# Altium schematic sheet Sensors.SchDoc
size A; SheetNumber: 6; SheetTotal: 7
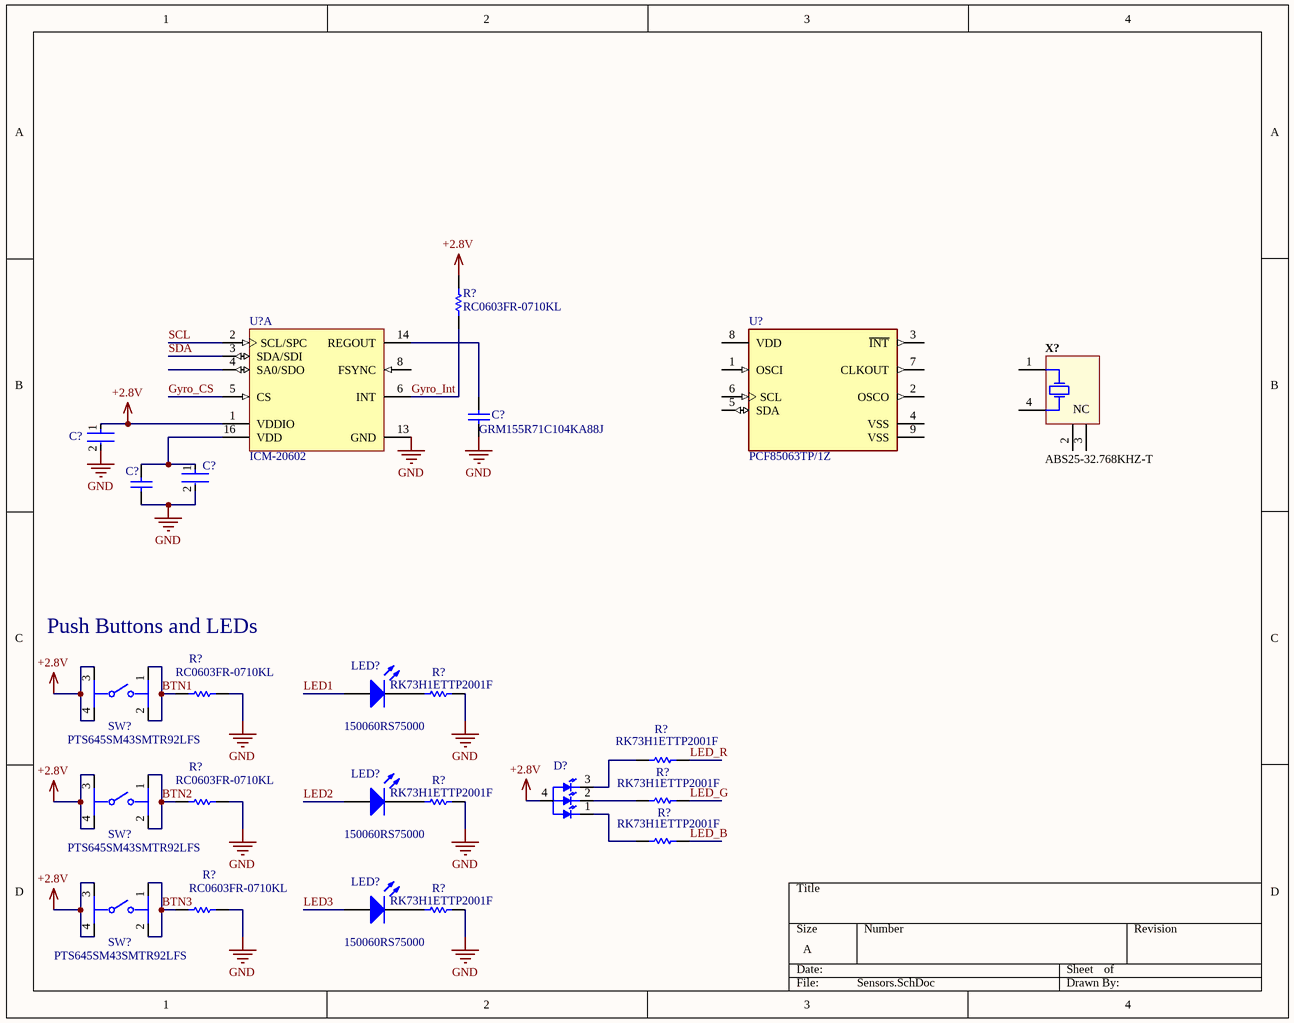
[diagram p0: Sensors.SchDoc]

## Parts
(Parts that share a designator on the sheet are numbered #1, #2 ... from top to bottom, then left to right.)
C?#1  CL10A225KO8NNNC  [FP-CL10-IPC_A]  (value not drawn)
C?#2  GRM155R71C104KA88J  [CAPC1005X55X25LL05T10]
C?#3  CL10A225KO8NNNC  [FP-CL10-IPC_A]  (value not drawn)
C?#4  GRM155R71C104KA88J  [CAPC1005X55X25LL05T10]  (value not drawn)
D?  UHD1110-FKA-CL1A13R3Q1BBQFMF3  [LED_UHD1110-FKA-CL1A13R3Q1BBQFMF3]  (value not drawn)
LED?#1  150060RS75000  [0603_A]
LED?#2  150060RS75000  [0603_A]
LED?#3  150060RS75000  [0603_A]
R?#1  RC0603FR-0710KL  [RESC1608X55X25ML10T15]
R?#2  RK73H1ETTP2001F  [RESC1005X40X25LL10T10]
R?#3  RC0603FR-0710KL  [RESC1608X55X25ML10T15]
R?#4  RK73H1ETTP2001F  [RESC1005X40X25LL10T10]
R?#5  RK73H1ETTP2001F  [RESC1005X40X25LL10T10]
R?#6  RK73H1ETTP2001F  [RESC1005X40X25LL10T10]
R?#7  RC0603FR-0710KL  [RESC1608X55X25ML10T15]
R?#8  RK73H1ETTP2001F  [RESC1005X40X25LL10T10]
R?#9  RK73H1ETTP2001F  [RESC1005X40X25LL10T10]
R?#10  RC0603FR-0710KL  [RESC1608X55X25ML10T15]
SW?#1  PTS645SM43SMTR92LFS  [FP-PTS645SM43SMTR92LFS-MFG]
SW?#2  PTS645SM43SMTR92LFS  [FP-PTS645SM43SMTR92LFS-MFG]
SW?#3  PTS645SM43SMTR92LFS  [FP-PTS645SM43SMTR92LFS-MFG]
U?#1  ICM-20602  [INSE-I62-16]  (part A of 2)
U?#2  PCF85063TP/1Z  [FP-SOT1069-2-MFG]
X?  ABS25-32.768KHZ-T  [ABRA-ABS25-4_V]

## Nets
+2.8V: C?#1.1 D?.4(ANODE) R?#1.2 SW?#1.3 SW?#1.4 SW?#2.3 SW?#2.4 SW?#3.3 SW?#3.4 U?#1.1(VDDIO)
GND: C?#1.2 C?#2.1 C?#3.2 C?#4.1 R?#2.2 R?#3.2 R?#5.2 R?#7.2 R?#9.2 R?#10.2 U?#1.13(GND)
BTN1: R?#3.1 SW?#1.1 SW?#1.2
BTN2: R?#7.1 SW?#2.1 SW?#2.2
BTN3: R?#10.1 SW?#3.1 SW?#3.2
Gyro_CS: U?#1.5(CS)
Gyro_Int: R?#1.1 U?#1.6(INT)
LED1: LED?#1.2(A)
LED2: LED?#2.2(A)
LED3: LED?#3.2(A)
LED_B: R?#8.2
LED_G: R?#6.2
LED_R: R?#4.2
SCL: U?#1.2(SCL/SPC)
SDA: U?#1.3(SDA/SDI)
NetC?#2_2: C?#2.2 U?#1.14(REGOUT)
NetC?#3_1: C?#3.1 C?#4.2 U?#1.16(VDD)
NetD?_1: D?.1(BLUE) R?#8.1
NetD?_2: D?.2(GREEN) R?#6.1
NetD?_3: D?.3(RED) R?#4.1
NetLED?#1_1: LED?#1.1(K) R?#2.1
NetLED?#2_1: LED?#2.1(K) R?#5.1
NetLED?#3_1: LED?#3.1(K) R?#9.1

Not connected (* = marked no-connect by the designer): U?#1 4(SA0/SDO) 8(FSYNC); U?#2 1(OSCI) 2(OSCO) 3(~{INT}) 4(VSS) 5(SDA) 6(SCL) 7(CLKOUT) 8(VDD) 9(VSS); X? 1(X1) 2(NC) 3(NC) 4(X2)

## Notes on the sheet
- Push Buttons and LEDs

## Library data of the parts
C?#1 C?#3 = CMP-13271-000835-1: Cap Ceramic 2.2uF 16V X5R ±10% Pad SMD 0603 +85°C T/R; Case Code (Metric): 1608; Height: 0.8mm; Case/Package: 0603; Depth: 0.8mm; Capacitance: 2.2uF; Voltage Rating: 16V; Case Code (Imperial): 0603; Length: 1.6mm; Packaging: Tape and Reel; Material: Ceramic; Lead Free: Lead Free; Max Operating Temperature: 85°C; Contact Plating: Tin; Thickness: 0.035inch; Radiation Hardening: No; Tolerance: 10%; Min Operating Temperature: -55°C; Voltage: 16V; Dielectric: X5R; Mount: Surface Mount; Package Quantity: 4000; Width: 0.031inch; Voltage Rating (DC): 16V
C?#2 C?#4 = CMP-2008-03928-1: Manufacturer: Murata; Part Number: GRM155R71C104KA88J
D? = UHD1110-FKA-CL1A13R3Q1BBQFMF3: Red, Green, Blue _RGB_ LED Indication - Discrete 1.9V Red, 2.9V Green, 2.9V Blue 0404 _1010 Metric_; MF: Cree Inc.; Price: None; Package: 0404 Cree Inc.; SnapEDA_Link: https://www.snapeda.com/parts/UHD1110-FKA-CL1A13R3Q1BBQFMF3/Cree%20Inc./view-part/2684282/?ref=snap; Value: *; MP: UHD1110-FKA-CL1A13R3Q1BBQFMF3; Availability: Unavailable
LED?#1-LED?#3 = CMP-1426-00001-1: SMD mono-color Chip LED, WL-SMCW, Red; Manufacturer: Wuerth Elektronik; Color: Red; PackageReference: 0603_A; ComponentLink2URL: http://katalog.we-online.com/led/datasheet/150060RS75000.pdf; ComponentLink1URL: http://www.we-online.com; ComponentLink1Description: Manufacturer URL; ComponentLink2Description: Datasheet; PartNumber: 150060RS75000
R?#1 R?#3 R?#7 R?#10 = CMP-2100-03664-1: Chip Resistor, 10 KOhm, +/- 1%, 01 W, -55 to 155 degC, 0603 (1608 Metric), RoHS, Tape and Reel; Manufacturer: Yageo; Temperature Coefficient: 100ppm/degreesC; Resistance: 10KOhm; Voltage Rating: 75V; Power Rating: 100mW; Voltage Rating (DC): 50V; Composition: ThickFilm; RoHSCompliant: true; Height: 0.45mm; Lead Free: LeadFree; Case Code (Metric): 1608; Case/Package: 0603; Datasheet Version: Rev. 5, 10/2016; Package Reference: 0603; Depth: 0.8mm; Package Description: 2-Pin Surface Mount Device, Body 1.6 x 0.8 mm; Case Code (Imperial): 0603; Packaging: TapeandReel; Termination: SMD/SMT; Lead Pitch: 0.3mm; Width: 0.8mm; Number of Pins: 2; Length: 1.6mm; REACH SVHC: NoSVHC; Military Standard: Not; Max Operating Temperature: 155degC; Min Operating Temperature: -55degC; Manufacturer URL: http://www.yageo.com/; Datasheet URL: http://www.yageo.com/NewPortal/yageodocoutput?fileName=/pdf/R-Chip/PYu-RC_Group_51_RoHS_L_5.pdf; Weight: 7.1E-05oz; Tolerance: 1%
R?#2 R?#4-R?#6 R?#8 R?#9 = CMP-2002-04283-1: Manufacturer: KOA Speer; Part Number: RK73H1ETTP2001F
SW?#1-SW?#3 = CMP-2000-05160-2: SWITCH TACTILE SPST-NO 0.05A 12V; Contact Resistance: 100mR; Throw Configuration: SPST; Illumination Type: Non-Illuminated; Mechanical Life: 100000Cycles; Current Rating: 50mA; Switch Function: Off-Mom; Actuator Length: 0.85mm; Actuator Material: Nylon; Actuator Type: Standard; Operating Force: 160gf; Min Operating Temperature: -20°C; REACH SVHC: No SVHC; Termination: Gull Wing; Case/Package: SMD/SMT; Packaging: Tape and Reel; Mount: Surface Mount; Voltage Rating (DC): 12V; Orientation: Straight; Lead Free: Lead Free; Contact Material: Silver; Color: Black; Max Current Rating: 50mA; Contact Plating: Silver; Depth: 9mm; Package Quantity: 1; Max Voltage Rating (DC): 12V; Length: 6mm; Max Operating Temperature: 60°C
U?#1 = CMP-2000-07589-1: High Performance 6-Axis MEMS MotionTracking(TM) Device, 1.71 to 3.45 V, -40 to 85 degC, 16-Pin LGA, RoHS; Manufacturer: InvenSense; Sensor Type: Temperature; Output Type: I2C; RoHSCompliant: True; Datasheet Version: Rev. 1.0, 10/2016; Datasheet URL: http://www.invensense.com/wp-content/uploads/2016/10/DS-000176-ICM-20602-v1.0.pdf; Min Operating Temperature: -40degC; Mounting Technology: SurfaceMount; Max Operating Temperature: 85degC; Manufacturer URL: http://www.invensense.com/; Package Reference: I62-16; Package Description: 16-Pin Land Grid Array, Body 3 x 3 mm, Pitch 0.5 mm
U?#2 = CMP-10083-000006-1: IC RTC CLK/CALENDAR I2C 8-SON; Manufacturer: NXP; Min Supply Voltage: 0.9V; Frequency: 400kHz; Max Supply Voltage: 5.5V; Standoff Height: 0mm; Number Of Outputs: 1; Nominal Supply Current: 0.22-18uA; ComponentLink2Description: Datasheet; Digikey Description: IC RTC CLK/CALENDAR I2C 8-SON; Mouser Description: Real Time Clock Low Power Real time clocks; Temperature Range High: +85°C; Category: IC; Ambient Temperature Range Low: -40°C; Device Class L3: Real Time Clocks; Ambient Temperature Range High: +85°C; Package: SOT1069-2; Temperature: -40°C to +85°C; Manufacturer Part Number: PCF85063TP/1Z; Interface: I2C; Height: 0.8mm; Octopart: https://octopart.com/pcf85063tp%2F1z-nxp+semiconductors-29857196; Device Class L2: Clock and Timing; Temperature Range Low: -40°C; Device Class L1: Integrated Circuits (ICs); Ipc Land Pattern Name: DFN200X300X75-8; Lead Free: Yes; ComponentLink2URL: https://www.nxp.com/docs/en/data-sheet/PCF85063TP.pdf; Automotive: No; Footprint Url: https://www.nxp.com/docs/en/package-information/SOT1069-2.pdf; RoHS: TRUE
X? = CMP-2000-05037-1: Low Frequency Crystal, 32.768 KHz, -40 to 85 degC, 4-Pin SMD, RoHS, Tape and Reel; Load Capacitance: 12.5pF; Tolerance: 20PPM; Brand: ABRACON; ESR: 50kOhms; Case Length: 8mm; Case Width: 3.8mm; Case Height: 2.5mm; RoHS: Details; Product Category: Crystals; Frequency: 32.768kHz; Datasheet Version: May-11; Series: ABS25; Datasheet URL: https://datasheet.ciiva.com/7998/1700987-7998663.pdf; Termination Style: SMD/SMT; Package Reference: ABS25; Dimensions: 3.8mmWx8mmLx2.5mmH; Package / Case: 8mmx3.8mm; Manufacturer: Abracon; Manufacturer URL: http://www.abracon.com/; Mounting Style: SMD/SMT; Package Description: 4-Pin Surface Mount Device, Body 8 x 3.8 mm, Pitch 5.5 mm; Operating Temperature Range: -40Cto+85C; Factory Pack Quantity: 1000; Type: LowFrequencyCrystal; Packaging: Reel